# Altium schematic sheet PMSM_500W_Controller_Driver.SchDoc
size 420 x 297 mm; SheetNumber: 4; Format: A3
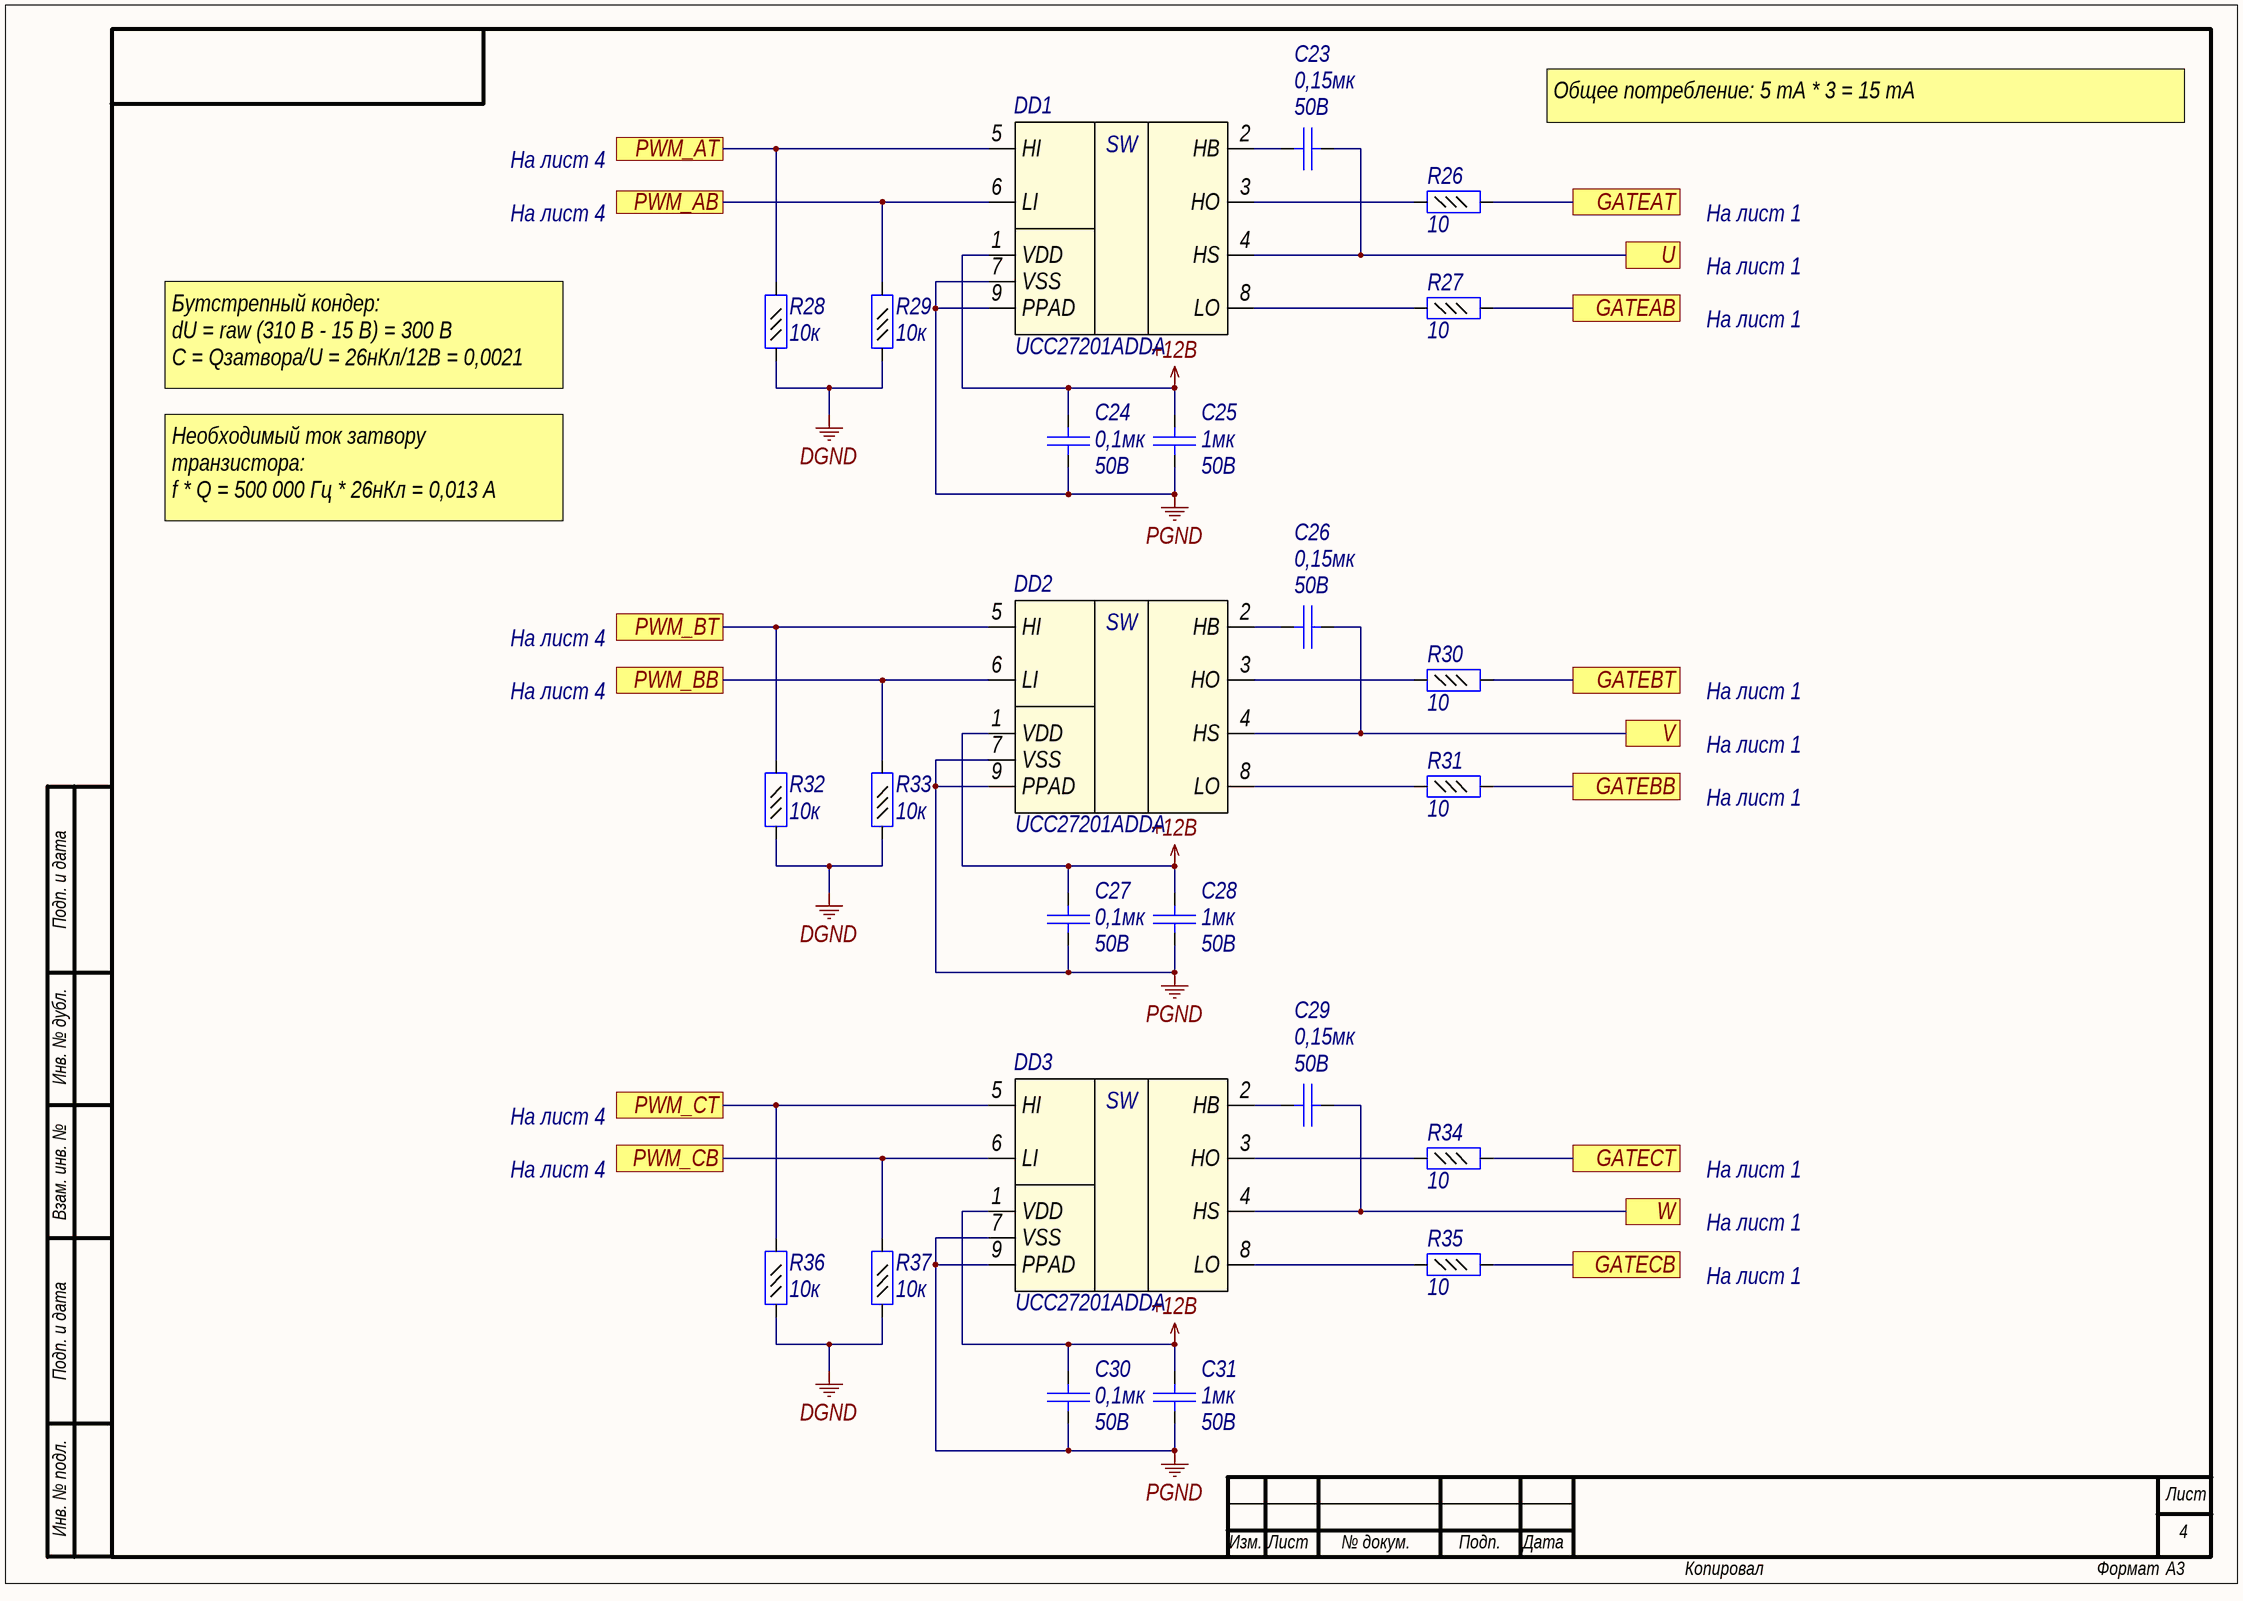
[diagram p0: PMSM_500W_Controller_Driver.SchDoc]

## Parts
C23  Voltage: 50В  [C1812]  (hidden comment: 0,15мк)
C24  value 0,1мк  Voltage: 50В  [C0402]  (hidden comment: Capacitor)
C25  value 1мк  Voltage: 50B  [C0805]  (hidden comment: Capacitor)
C26  Voltage: 50В  [C1812]  (hidden comment: 0,15мк)
C27  value 0,1мк  Voltage: 50В  [C0402]  (hidden comment: Capacitor)
C28  value 1мк  Voltage: 50B  [C0805]  (hidden comment: Capacitor)
C29  Voltage: 50В  [C1812]  (hidden comment: 0,15мк)
C30  value 0,1мк  Voltage: 50В  [C0402]  (hidden comment: Capacitor)
C31  value 1мк  Voltage: 50B  [C0805]  (hidden comment: Capacitor)
DD1  Part Number: UCC27201ADDA  [SO8 POWERPAD]  (hidden comment: UCC27201A)
DD2  Part Number: UCC27201ADDA  [SO8 POWERPAD]  (hidden comment: UCC27201A)
DD3  Part Number: UCC27201ADDA  [SO8 POWERPAD]  (hidden comment: UCC27201A)
R26  value 10  [R0402]  (hidden comment: Resistor_0,062Вт)
R27  value 10  [R0402]  (hidden comment: Resistor_0,062Вт)
R28  value 10к  [R0402]  (hidden comment: Resistor_0,062Вт)
R29  value 10к  [R0402]  (hidden comment: Resistor_0,062Вт)
R30  value 10  [R0402]  (hidden comment: Resistor_0,062Вт)
R31  value 10  [R0402]  (hidden comment: Resistor_0,062Вт)
R32  value 10к  [R0402]  (hidden comment: Resistor_0,062Вт)
R33  value 10к  [R0402]  (hidden comment: Resistor_0,062Вт)
R34  value 10  [R0402]  (hidden comment: Resistor_0,062Вт)
R35  value 10  [R0402]  (hidden comment: Resistor_0,062Вт)
R36  value 10к  [R0402]  (hidden comment: Resistor_0,062Вт)
R37  value 10к  [R0402]  (hidden comment: Resistor_0,062Вт)

## Ports
GATEAB, GATEAT, GATEBB, GATEBT, GATECB, GATECT, PWM_AB, PWM_AT, PWM_BB, PWM_BT, PWM_CB, PWM_CT, U, V, W

## Nets
+12B: C24.2 C25.2 C27.2 C28.2 C30.2 C31.2 DD1.1(VDD) DD2.1(VDD) DD3.1(VDD)
DGND: R28.1 R29.1 R32.1 R33.1 R36.1 R37.1
PGND: C24.1 C25.1 C27.1 C28.1 C30.1 C31.1 DD1.7(VSS) DD1.9(PPAD) DD2.7(VSS) DD2.9(PPAD) DD3.7(VSS) DD3.9(PPAD)
GATEAB: R27.2 ; port GATEAB
GATEAT: R26.2 ; port GATEAT
GATEBB: R31.2 ; port GATEBB
GATEBT: R30.2 ; port GATEBT
GATECB: R35.2 ; port GATECB
GATECT: R34.2 ; port GATECT
PWM_AB: DD1.6(LI) R29.2 ; port PWM_AB
PWM_AT: DD1.5(HI) R28.2 ; port PWM_AT
PWM_BB: DD2.6(LI) R33.2 ; port PWM_BB
PWM_BT: DD2.5(HI) R32.2 ; port PWM_BT
PWM_CB: DD3.6(LI) R37.2 ; port PWM_CB
PWM_CT: DD3.5(HI) R36.2 ; port PWM_CT
U: C23.2 DD1.4(HS) ; port U
V: C26.2 DD2.4(HS) ; port V
W: C29.2 DD3.4(HS) ; port W
NetC23_1: C23.1 DD1.2(HB)
NetC26_1: C26.1 DD2.2(HB)
NetC29_1: C29.1 DD3.2(HB)
NetDD1_3: DD1.3(HO) R26.1
NetDD1_8: DD1.8(LO) R27.1
NetDD2_3: DD2.3(HO) R30.1
NetDD2_8: DD2.8(LO) R31.1
NetDD3_3: DD3.3(HO) R34.1
NetDD3_8: DD3.8(LO) R35.1

## Notes on the sheet
- Общее потребление: 5 mA * 3 = 15 mA
- На лист 4
- На лист 1
- Бутстрепный кондер:
  dU = raw (310 B - 15 B) = 300 B
  C = Qзатвора/U = 26нКл/12В = 0,0021 мкФ
- Необходимый ток затвору транзистора:
  f * Q = 500 000 Гц * 26нКл = 0,013 А
  Ток на затвор = 12В / 10 ом = 1,2 А
- Подп. и дата
- Инв. № дубл.
- Взам. инв. №
- Инв. № подл.
- Лист
- Изм.
- № докум.
- Подп.
- Дата
- Копировал
- Формат
- (in symbol driver25) SW

## Library data of the parts
C23 C26 C29 = cap285: Конденсатор; Part Name: Ceramic; Manufacture: TDK; Part Number: C4532C0G1H154J250KA; id: cap285; TKE: NP0; Value: 0,15мк
C24 C27 C30 = cap277: Конденсатор; Part Name: Ceramic; Manufacture: Murata; Part Number: GRM155R71H104KE14D; id: cap277; TKE: X7R; tga: 0,10%
C25 C28 C31 = cap151: Конденсатор; Part Name: Ceramic; Manufacture: Murata; Part Number: GRM21BR71H105K; id: cap151; TKE: X7R
DD1-DD3 = driver25: 120-V Boot, 3-A Peak, High-Frequency, High-Side and Low-Side Driver; Part Name: High-Side/Low-Side Driver; Manufacture: Texas Instruments; Logic High: 1,6B-2,5B; Logic Low: 0,8B-1,6B; Min Operating Supply Voltage: 8B; Max Operating Supply Voltage: 17B; Vbus: 120B; “A” OUTPUT: Noninverting; Maximum output current: 3A; Maximum Power Dissipation: 2,7W; id: driver25; “B” OUTPUT: Noninverting
R26 R27 R30 R31 R34 R35 = res222: Резистор; Manufacture: Yageo; Part Number: RC0402FR-0710RL; id: res222; Accuracy: 0,01; Part Name: Resistor; Power: 0,062Вт
R28 R29 R32 R33 R36 R37 = res294: Резистор; Manufacture: Yageo; Part Number: RC0402FR-0710KL; id: res294; Accuracy: 0,01; Part Name: Resistor; Power: 0,062Вт